# EasyEDA schematic Design.json
TITLE: PCB-LI-ION; REV: 1.0; Date: 2024-08-16; Sheet: 1/1; Drawn By: shahm; Company: Lolz
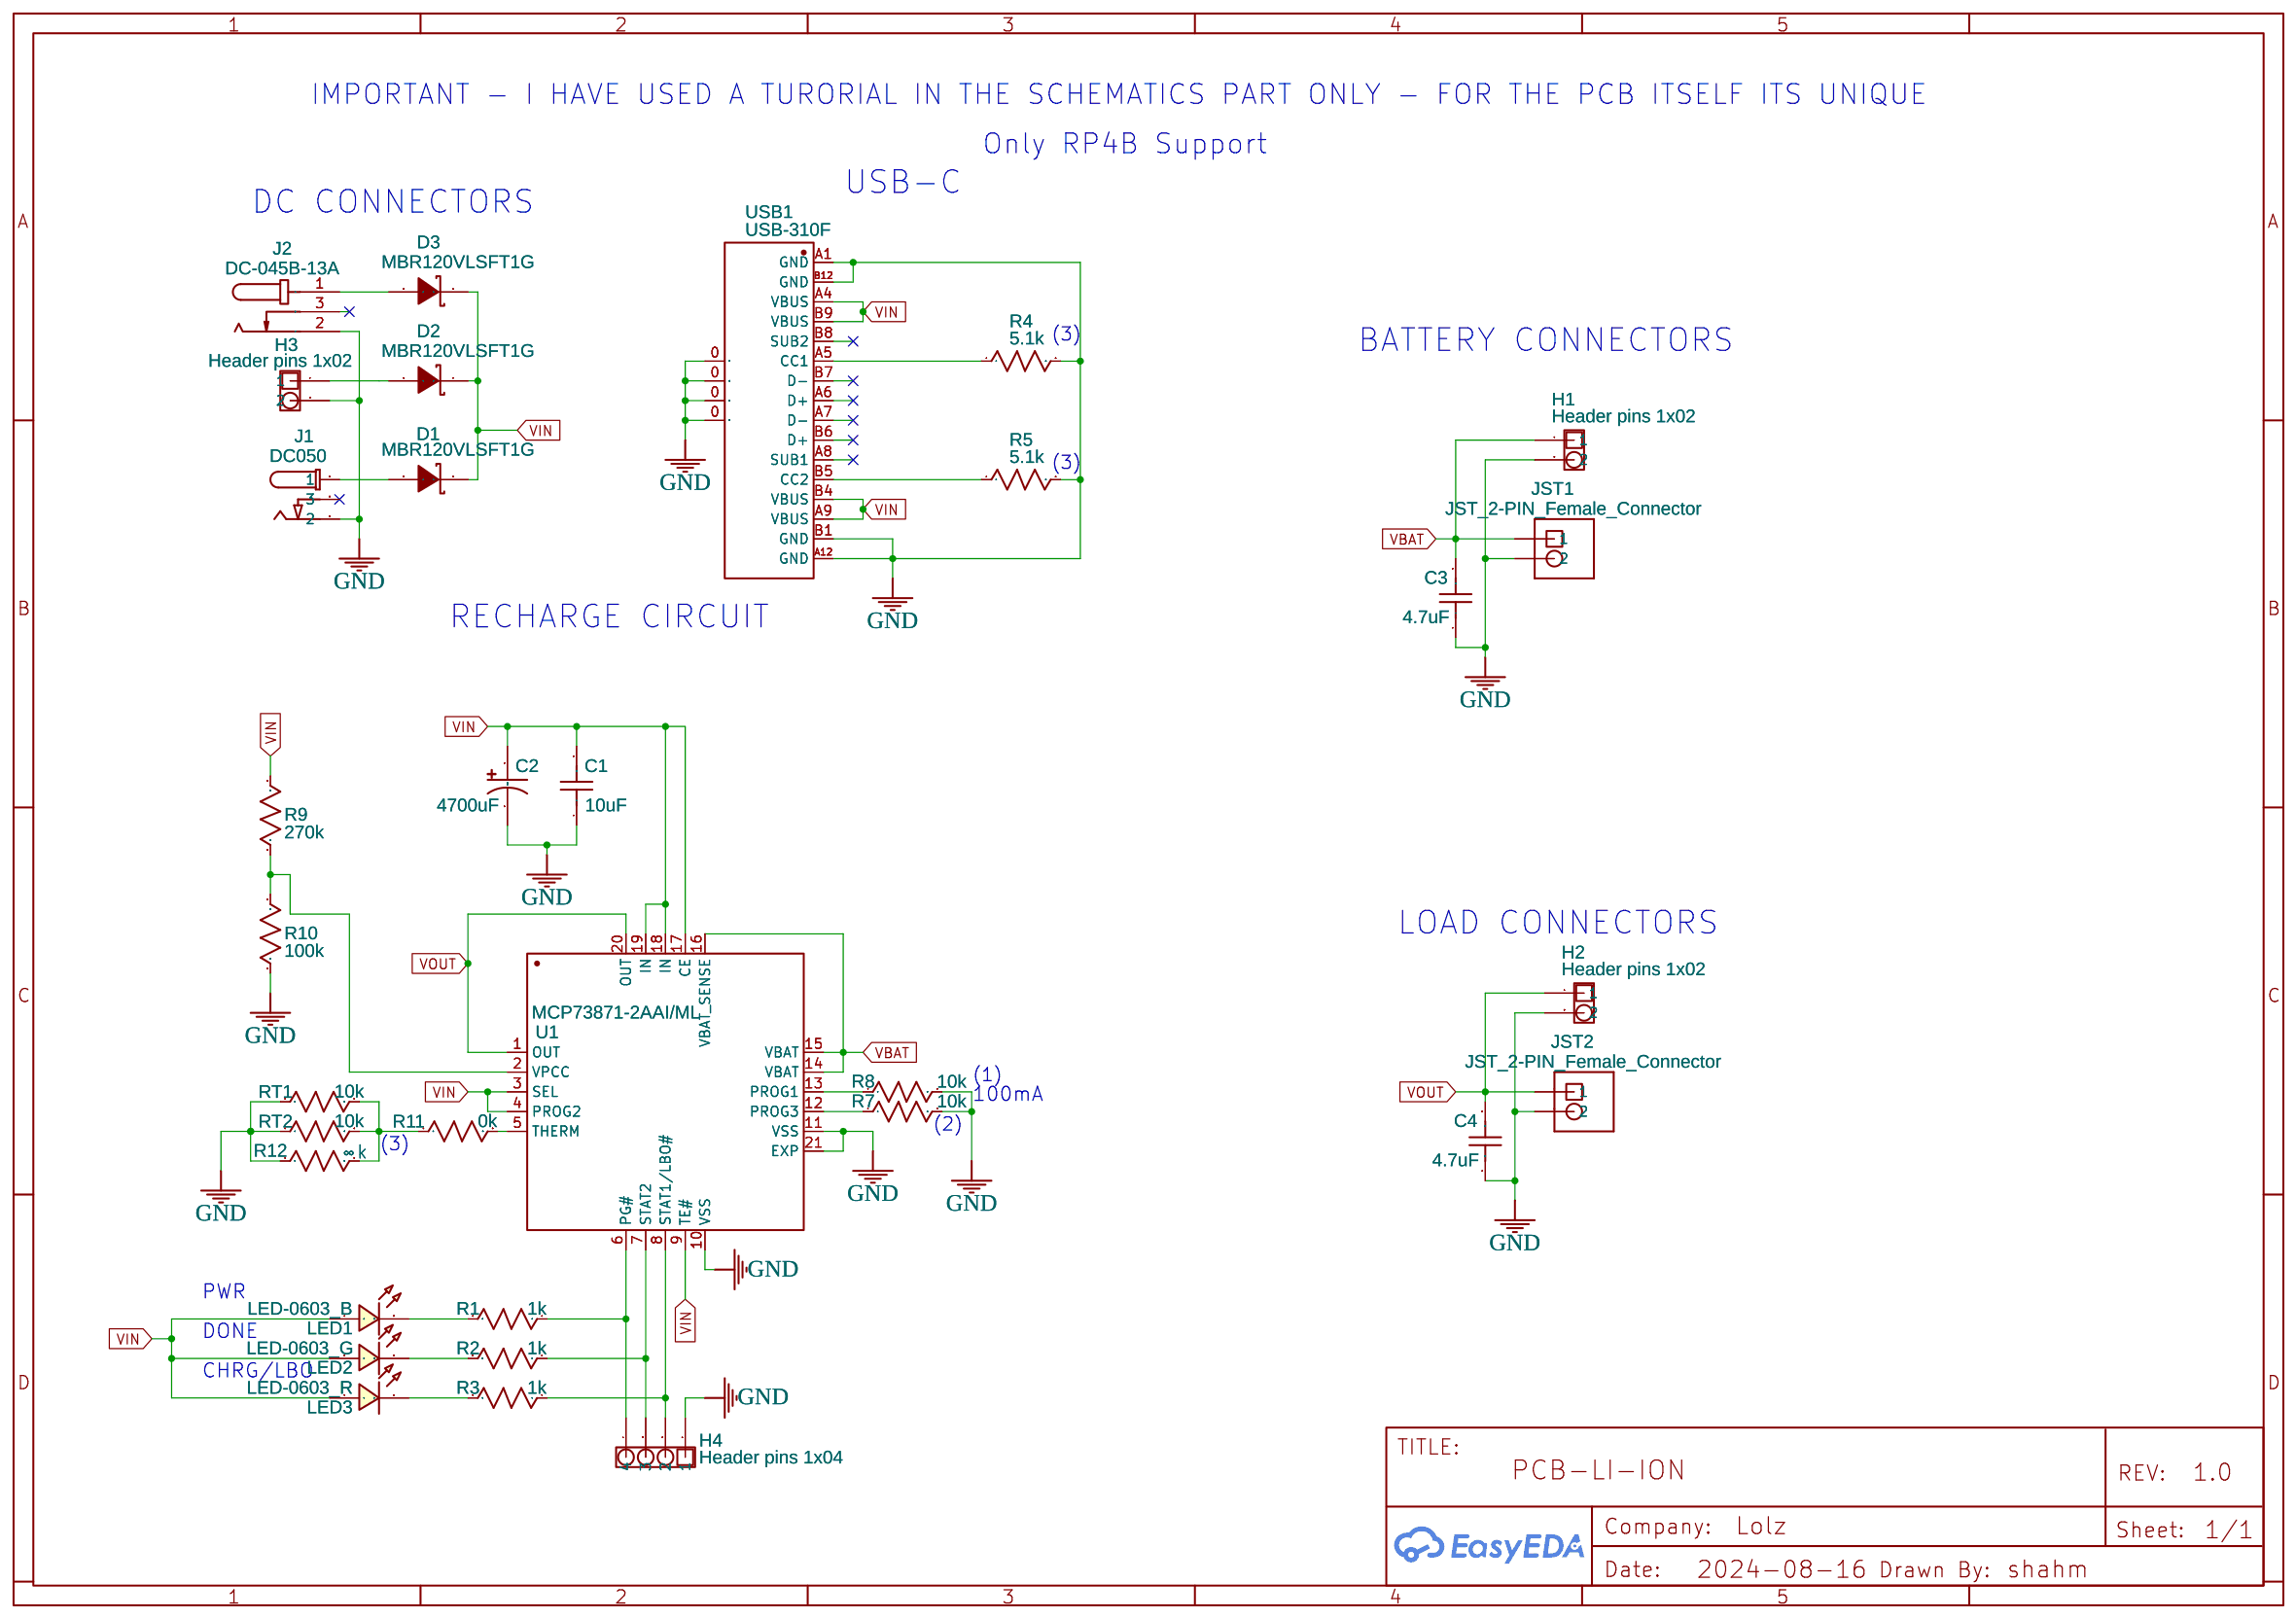
[diagram p0: schematic sheet]

## Parts
C1  10uF  [C0603]
C2  4700uF  [CAP-TH_BD12.5-P5.00-D1.2-FD]
C3  4.7uF  [C0603]
C4  4.7uF  [C0603]
D1  MBR120VLSFT1G  [SOD-123F_L2.8-W1.8-LS3.7-RD]
D2  MBR120VLSFT1G  [SOD-123F_L2.8-W1.8-LS3.7-RD]
D3  MBR120VLSFT1G  [SOD-123F_L2.8-W1.8-LS3.7-RD]
H1  Header pins 1x02  [1X02 2.54MM HOLES HEADERS PINS]
H2  Header pins 1x02  [1X02 2.54MM HOLES HEADERS PINS]
H3  Header pins 1x02  [1X02 2.54MM HOLES HEADERS PINS]
H4  Header pins 1x04  [1X04 2.54MM HOLES HEADERS PINS]
J1  DC050  [DC050 DC POWER CONNECTOR]
J2  DC-045B-13A  [DC-IN-SMD_DC-045B-13A]
JST1  JST_2-PIN_Female_Connector  [JST-PH-2-SMT-RA]
JST2  JST_2-PIN_Female_Connector  [JST-PH-2-SMT-RA]
LED1  LED-0603_B  [LED0603_BLUE]
LED2  LED-0603_G  [LED0603_GREEN]
LED3  LED-0603_R  [LED0603_RED]
R1  1k  [R0603]
R2  1k  [R0603]
R3  1k  [R0603]
R4  5.1k  [R0603]
R5  5.1k  [R0603]
R7  10k  [R0603]
R8  10k  [R0603]
R9  270k  [R0603]
R10  100k  [R0603]
R11  0k  [R0603]
R12  ∞k  [R0603]
RT1  10k  [R_AXIAL-0.3]
RT2  10k  [R0603]
U1  MCP73871-2AAI/ML  [QFN-20_L4.0-W4.0-P0.50-BL-EP]
USB1  USB-310F  [USB-C-SMD_20P-P0.50-L6.5-W8.9]

## Library data of the parts
C1 C3 C4 = C_0603_US: Contributor: LCEDA_Lib
C2 = EEUFR1A472L: Supplier: LCSC; Supplier Part: C407873; Manufacturer: PANASONIC; Contributor: LCSC
D1-D3 = MBR120VLSFT1G: Supplier: LCSC; Supplier Part: C223608; Manufacturer: ON Semicon; Contributor: LCSC; LCSC Assembly: Yes; SMT Type: Extend
H1-H3 = Header pins 1x02: Contributor: fabiano.riccardi
H4 = Header pins 1x04: Contributor: fabiano.riccardi
J1 = DC050 DC POWER CONNECTOR: Manufacturer: SHOU HAN; Manufacturer Part: DC00050-A; Supplier Part: C431534; Supplier: LCSC; link: https://lcsc.com/product-detail/AC-DC-Power-Plugs-Receptacles_SHOU-HAN-DC050-T_C431534.html; Contributor: FabianoRiccardi
J2 = DC-045B-13A: Supplier: LCSC; Manufacturer: HRO; Contributor: LCSC; Supplier Part: C145925
JST1 JST2 = JST_2-PIN_Female_Connector: Contributor: fabiano.riccardi
LED1 = LED-0603_B: Manufacturer: EVERLIGHT(台湾亿光); Manufacturer Part: 19-217/BHC-ZL1M2RY/3T; Supplier Part: C72041; Supplier: LCSC; Contributor: LCEDA_01
LED2 = LED-0603_G: Manufacturer: EVERLIGHT(台湾亿光); Manufacturer Part: 19-217/GHC-YR1S2/3T; Supplier Part: C72043; Supplier: LCSC; Contributor: LCEDA_Lib
LED3 = LED-0603_R: Manufacturer: EVERLIGHT(台湾亿光); Manufacturer Part: 19-217/R6C-AL1M2VY/3T; Supplier Part: C72044; Supplier: LCSC; Contributor: LCEDA_01
R1-R5 R7-R12 RT1 RT2 = R_0603_US: Contributor: LCEDA_Lib
U1 = MCP73871-2AAI/ML: Supplier: LCSC; Manufacturer: MICROCHIP; Contributor: LCSC; Supplier Part: C144351; LCSC Assembly: Yes; SMT Type: Extend
USB1 = USB-310F: Supplier: LCSC; Supplier Part: C309365; Manufacturer: HOOYA; Contributor: LCSC

## Nets
GND: C1.1 C2.2 C3.1 C4.1 H1.2 H2.2 H3.2 H4.1 J1.2 J2.2 JST1.2 JST2.2 R4.2 R5.2 R7.2 R8.2 R10.1 R12.1 RT1.1 RT2.1 U1.10(VSS) U1.11(VSS) U1.21(EXP) USB1.0 USB1.A1(GND) USB1.A12(GND) USB1.B1(GND) USB1.B12(GND)
VBAT: C3.2 H1.1 JST1.1 U1.14(VBAT) U1.15(VBAT) U1.16(VBAT_SENSE)
VIN: C1.2 C2.1 D1.1(K) D2.1(K) D3.1(K) LED1.1 LED2.1 LED3.1 R9.2 U1.3(SEL) U1.4(PROG2) U1.9(TE#) U1.17(CE) U1.18(IN) U1.19(IN) USB1.A4(VBUS) USB1.A9(VBUS) USB1.B4(VBUS) USB1.B9(VBUS)
VOUT: C4.2 H2.1 JST2.1 U1.1(OUT) U1.20(OUT)
Net-(D1-2): D1.2(A) J1.1
Net-(D2-2): D2.2(A) H3.1
Net-(D3-2): D3.2(A) J2.1
Net-(H4-2): H4.2 R3.1 U1.8(STAT1/LBO#)
Net-(H4-3): H4.3 R2.1 U1.7(STAT2)
Net-(H4-4): H4.4 R1.1 U1.6(PG#)
Net-(LED1-2): LED1.2 R1.2
Net-(LED2-2): LED2.2 R2.2
Net-(LED3-2): LED3.2 R3.2
Net-(R4-1): R4.1 USB1.A5(CC1)
Net-(R5-1): R5.1 USB1.B5(CC2)
Net-(R7-1): R7.1 U1.12(PROG3)
Net-(R8-1): R8.1 U1.13(PROG1)
Net-(R9-1): R9.1 R10.2 U1.2(VPCC)
Net-(R11-1): R11.1 R12.2 RT1.2 RT2.2
Net-(R11-2): R11.2 U1.5(THERM)

Not connected (* = marked no-connect by the designer): J1 3*; J2 3; USB1 A6(D+) A7(D-) A8(SUB1) B6(D+) B7(D-) B8(SUB2)

## Notes on the sheet
- IMPORTANT - I HAVE USED A TURORIAL IN THE SCHEMATICS PART ONLY - FOR THE PCB ITSELF ITS UNIQUE
- Only RP4B Support
- USB-C
- DC CONNECTORS
- (3)
- BATTERY CONNECTORS
- (3)
- RECHARGE CIRCUIT
- LOAD CONNECTORS
- (1)
- 100mA
- (2)
- (3)
- PWR
- DONE
- CHRG/LBO
